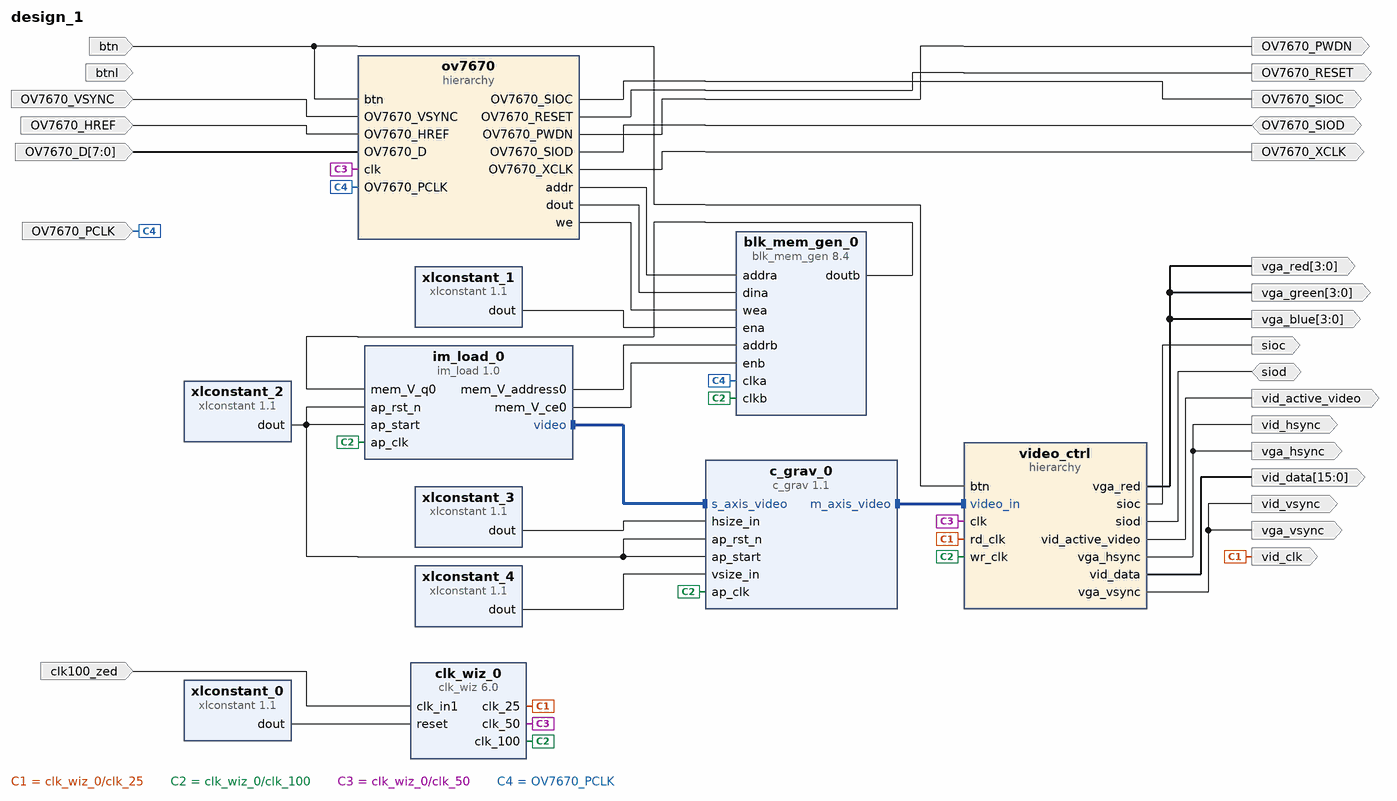
[diagram p0: block diagram of the top level]
# Vivado block design design_1, xc7z020clg484-1, Vivado 2019.2
create_bd_design design_1

create_bd_port -dir I -type clk clk100_zed
create_bd_port -dir O -from 3 -to 0 vga_red
create_bd_port -dir O -from 3 -to 0 vga_green
create_bd_port -dir O -from 3 -to 0 vga_blue
create_bd_port -dir O vga_hsync
create_bd_port -dir O vga_vsync
create_bd_port -dir I btnl
create_bd_port -dir O -from 15 -to 0 vid_data
create_bd_port -dir O vid_hsync
create_bd_port -dir O vid_vsync
create_bd_port -dir O vid_clk
create_bd_port -dir O vid_active_video
create_bd_port -dir IO siod
create_bd_port -dir O sioc
create_bd_port -dir I btn
create_bd_port -dir O OV7670_SIOC
create_bd_port -dir IO OV7670_SIOD
create_bd_port -dir O -type rst OV7670_RESET
create_bd_port -dir O OV7670_PWDN
create_bd_port -dir O OV7670_XCLK
create_bd_port -dir I OV7670_PCLK
create_bd_port -dir I OV7670_VSYNC
create_bd_port -dir I OV7670_HREF
create_bd_port -dir I -from 7 -to 0 OV7670_D

create_bd_cell -type ip -vlnv xilinx.com:ip:clk_wiz:6.0 clk_wiz_0
set_property -dict [list \
  CONFIG.CLKOUT1_JITTER 130.958 \
  CONFIG.CLKOUT1_REQUESTED_OUT_FREQ 100.000 \
  CONFIG.CLKOUT2_JITTER 151.636 \
  CONFIG.CLKOUT2_PHASE_ERROR 98.575 \
  CONFIG.CLKOUT2_REQUESTED_OUT_FREQ 50.000 \
  CONFIG.CLKOUT2_USED true \
  CONFIG.CLKOUT3_JITTER 175.402 \
  CONFIG.CLKOUT3_PHASE_ERROR 98.575 \
  CONFIG.CLKOUT3_REQUESTED_OUT_FREQ 25.000 \
  CONFIG.CLKOUT3_USED true \
  CONFIG.CLK_OUT1_PORT clk_100 \
  CONFIG.CLK_OUT2_PORT clk_50 \
  CONFIG.CLK_OUT3_PORT clk_25 \
  CONFIG.MMCM_CLKOUT0_DIVIDE_F 10.000 \
  CONFIG.MMCM_CLKOUT1_DIVIDE 20 \
  CONFIG.MMCM_CLKOUT2_DIVIDE 40 \
  CONFIG.NUM_OUT_CLKS 3 \
] [get_bd_cells clk_wiz_0]
create_bd_cell -type ip -vlnv xilinx.com:ip:xlconstant:1.1 xlconstant_0
set_property -dict {CONFIG.CONST_VAL 0} [get_bd_cells xlconstant_0]
create_bd_cell -type hier video_ctrl
create_bd_cell -type ip -vlnv xilinx.com:ip:xlconstant:1.1 xlconstant_2
create_bd_cell -type ip -vlnv xilinx.com:hls:im_load:1.0 im_load_0
create_bd_cell -type ip -vlnv xilinx.com:ip:blk_mem_gen:8.4 blk_mem_gen_0
set_property -dict [list \
  CONFIG.Enable_32bit_Address false \
  CONFIG.Enable_A Use_ENA_Pin \
  CONFIG.Enable_B Use_ENB_Pin \
  CONFIG.Load_Init_File false \
  CONFIG.Memory_Type Simple_Dual_Port_RAM \
  CONFIG.Operating_Mode_A NO_CHANGE \
  CONFIG.Port_B_Clock 100 \
  CONFIG.Port_B_Enable_Rate 100 \
  CONFIG.Read_Width_B 8 \
  CONFIG.Register_PortB_Output_of_Memory_Primitives true \
  CONFIG.Use_Byte_Write_Enable false \
  CONFIG.Use_RSTB_Pin false \
  CONFIG.Write_Depth_A 307200 \
  CONFIG.Write_Width_A 8 \
  CONFIG.Write_Width_B 8 \
  CONFIG.use_bram_block Stand_Alone \
] [get_bd_cells blk_mem_gen_0]
create_bd_cell -type ip -vlnv xilinx.com:ip:xlconstant:1.1 xlconstant_1
set_property -dict {CONFIG.CONST_VAL 1} [get_bd_cells xlconstant_1]
create_bd_cell -type hier ov7670
create_bd_cell -type ip -vlnv xilinx.com:hls:c_grav:1.1 c_grav_0
create_bd_cell -type ip -vlnv xilinx.com:ip:xlconstant:1.1 xlconstant_3
set_property -dict {CONFIG.CONST_VAL 640 CONFIG.CONST_WIDTH 32} [get_bd_cells xlconstant_3]
create_bd_cell -type ip -vlnv xilinx.com:ip:xlconstant:1.1 xlconstant_4
set_property -dict {CONFIG.CONST_VAL 480 CONFIG.CONST_WIDTH 32} [get_bd_cells xlconstant_4]

# ---- hierarchy /video_ctrl ----
current_bd_instance /video_ctrl
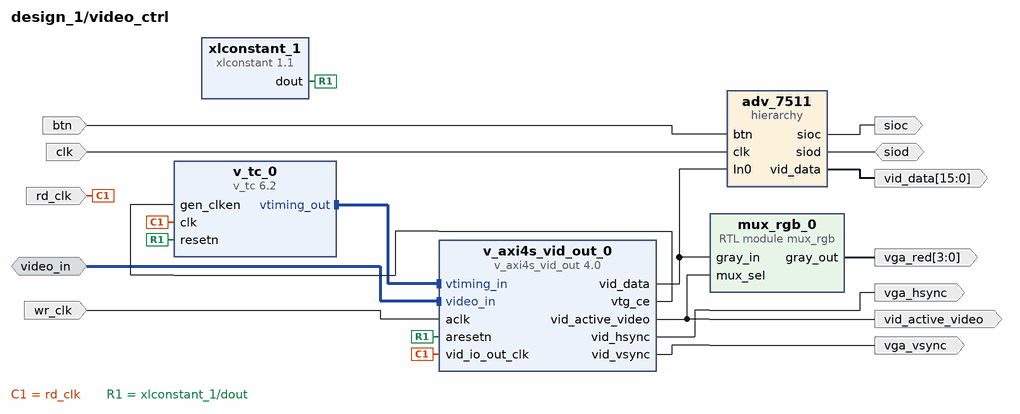
[diagram p1: block diagram inside /video_ctrl]
create_bd_intf_pin -mode Slave -vlnv xilinx.com:interface:axis_rtl:1.0 video_in
create_bd_pin -dir I -type clk rd_clk
create_bd_pin -dir O vga_hsync
create_bd_pin -dir O vga_vsync
create_bd_pin -dir I -type clk wr_clk
create_bd_pin -dir O vid_active_video
create_bd_pin -dir O -from 15 -to 0 vid_data
create_bd_pin -dir I btn
create_bd_pin -dir IO siod
create_bd_pin -dir O sioc
create_bd_pin -dir I -type clk clk
create_bd_pin -dir O -from 3 -to 0 vga_red

create_bd_cell -type ip -vlnv xilinx.com:ip:xlconstant:1.1 xlconstant_1
create_bd_cell -type ip -vlnv xilinx.com:ip:v_tc:6.2 v_tc_0
set_property -dict [list \
  CONFIG.FSYNC_VSTART0 524 \
  CONFIG.HAS_AXI4_LITE false \
  CONFIG.VIDEO_MODE 480p \
  CONFIG.enable_detection false \
  CONFIG.horizontal_blank_generation true \
  CONFIG.vertical_blank_generation true \
] [get_bd_cells v_tc_0]
create_bd_cell -type ip -vlnv xilinx.com:ip:v_axi4s_vid_out:4.0 v_axi4s_vid_out_0
set_property -dict {CONFIG.C_HAS_ASYNC_CLK 1 CONFIG.C_S_AXIS_VIDEO_FORMAT 12} [get_bd_cells v_axi4s_vid_out_0]
create_bd_cell -type hier adv_7511
create_bd_cell -type module -reference mux_rgb mux_rgb_0

# ---- hierarchy /video_ctrl/adv_7511 ----
current_bd_instance /video_ctrl/adv_7511
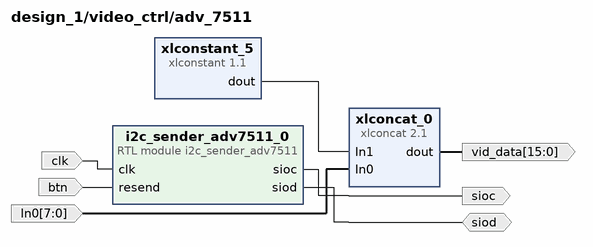
[diagram p2: block diagram inside /video_ctrl/adv_7511]
create_bd_pin -dir I -from 7 -to 0 In0
create_bd_pin -dir O -from 15 -to 0 vid_data
create_bd_pin -dir I -type clk clk
create_bd_pin -dir I btn
create_bd_pin -dir O sioc
create_bd_pin -dir IO siod

create_bd_cell -type ip -vlnv xilinx.com:ip:xlconcat:2.1 xlconcat_0
set_property -dict {CONFIG.IN0_WIDTH 8 CONFIG.IN1_WIDTH 8} [get_bd_cells xlconcat_0]
create_bd_cell -type module -reference i2c_sender_adv7511 i2c_sender_adv7511_0
create_bd_cell -type ip -vlnv xilinx.com:ip:xlconstant:1.1 xlconstant_5
set_property -dict {CONFIG.CONST_VAL 127 CONFIG.CONST_WIDTH 8} [get_bd_cells xlconstant_5]

# ---- hierarchy /ov7670 ----
current_bd_instance /ov7670
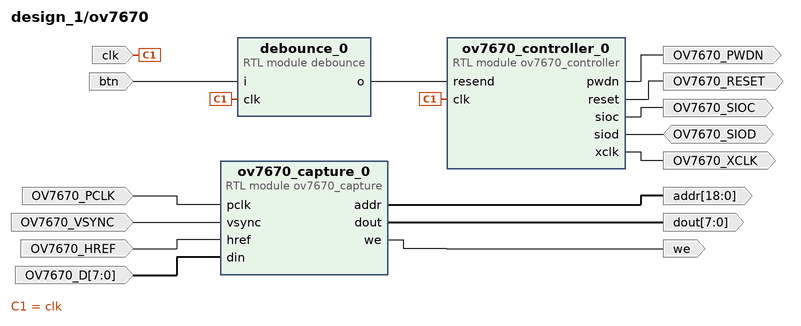
[diagram p3: block diagram inside /ov7670]
create_bd_pin -dir I -type clk clk
create_bd_pin -dir O OV7670_SIOC
create_bd_pin -dir IO OV7670_SIOD
create_bd_pin -dir O -type rst OV7670_RESET
create_bd_pin -dir O OV7670_PWDN
create_bd_pin -dir O OV7670_XCLK
create_bd_pin -dir I btn
create_bd_pin -dir I OV7670_PCLK
create_bd_pin -dir I OV7670_VSYNC
create_bd_pin -dir I OV7670_HREF
create_bd_pin -dir I -from 7 -to 0 OV7670_D
create_bd_pin -dir O -from 18 -to 0 addr
create_bd_pin -dir O -from 7 -to 0 dout
create_bd_pin -dir O we

create_bd_cell -type module -reference ov7670_controller ov7670_controller_0
create_bd_cell -type module -reference debounce debounce_0
create_bd_cell -type module -reference ov7670_capture ov7670_capture_0

# ---- connections ----

current_bd_instance /video_ctrl
connect_bd_intf_net [get_bd_intf_pins video_in] [get_bd_intf_pins v_axi4s_vid_out_0/video_in]
connect_bd_intf_net [get_bd_intf_pins v_tc_0/vtiming_out] [get_bd_intf_pins v_axi4s_vid_out_0/vtiming_in]
connect_bd_net -net clk_wiz_0_clk_25 [get_bd_pins rd_clk] [get_bd_pins v_tc_0/clk] [get_bd_pins v_axi4s_vid_out_0/vid_io_out_clk]
connect_bd_net [get_bd_pins v_axi4s_vid_out_0/vtg_ce] [get_bd_pins v_tc_0/gen_clken]
connect_bd_net [get_bd_pins wr_clk] [get_bd_pins v_axi4s_vid_out_0/aclk]
connect_bd_net [get_bd_pins v_axi4s_vid_out_0/vid_hsync] [get_bd_pins vga_hsync]
connect_bd_net [get_bd_pins v_axi4s_vid_out_0/vid_vsync] [get_bd_pins vga_vsync]
connect_bd_net [get_bd_pins xlconstant_1/dout] [get_bd_pins v_tc_0/resetn] [get_bd_pins v_axi4s_vid_out_0/aresetn]
connect_bd_net [get_bd_pins v_axi4s_vid_out_0/vid_data] [get_bd_pins adv_7511/In0] [get_bd_pins mux_rgb_0/gray_in]
connect_bd_net [get_bd_pins v_axi4s_vid_out_0/vid_active_video] [get_bd_pins vid_active_video] [get_bd_pins mux_rgb_0/mux_sel]
connect_bd_net -net xlconcat_0_dout [get_bd_pins adv_7511/vid_data] [get_bd_pins vid_data]
connect_bd_net [get_bd_pins btn] [get_bd_pins adv_7511/btn]
connect_bd_net [get_bd_pins siod] [get_bd_pins adv_7511/siod]
connect_bd_net -net i2c_sender_adv7511_0_sioc [get_bd_pins adv_7511/sioc] [get_bd_pins sioc]
connect_bd_net [get_bd_pins clk] [get_bd_pins adv_7511/clk]
connect_bd_net [get_bd_pins mux_rgb_0/gray_out] [get_bd_pins vga_red]

current_bd_instance /video_ctrl/adv_7511
connect_bd_net [get_bd_pins xlconstant_5/dout] [get_bd_pins xlconcat_0/In1]
connect_bd_net -net v_axi4s_vid_out_0_vid_data [get_bd_pins In0] [get_bd_pins xlconcat_0/In0]
connect_bd_net [get_bd_pins xlconcat_0/dout] [get_bd_pins vid_data]
connect_bd_net [get_bd_pins clk] [get_bd_pins i2c_sender_adv7511_0/clk]
connect_bd_net [get_bd_pins btn] [get_bd_pins i2c_sender_adv7511_0/resend]
connect_bd_net [get_bd_pins i2c_sender_adv7511_0/sioc] [get_bd_pins sioc]
connect_bd_net [get_bd_pins siod] [get_bd_pins i2c_sender_adv7511_0/siod]

current_bd_instance /ov7670
connect_bd_net [get_bd_pins debounce_0/o] [get_bd_pins ov7670_controller_0/resend]
connect_bd_net -net clk_wiz_0_clk_50 [get_bd_pins clk] [get_bd_pins debounce_0/clk] [get_bd_pins ov7670_controller_0/clk]
connect_bd_net [get_bd_pins ov7670_controller_0/sioc] [get_bd_pins OV7670_SIOC]
connect_bd_net [get_bd_pins OV7670_SIOD] [get_bd_pins ov7670_controller_0/siod]
connect_bd_net [get_bd_pins ov7670_controller_0/reset] [get_bd_pins OV7670_RESET]
connect_bd_net [get_bd_pins ov7670_controller_0/pwdn] [get_bd_pins OV7670_PWDN]
connect_bd_net [get_bd_pins ov7670_controller_0/xclk] [get_bd_pins OV7670_XCLK]
connect_bd_net -net i_0_1 [get_bd_pins btn] [get_bd_pins debounce_0/i]
connect_bd_net -net pclk_0_1 [get_bd_pins OV7670_PCLK] [get_bd_pins ov7670_capture_0/pclk]
connect_bd_net -net vsync_0_1 [get_bd_pins OV7670_VSYNC] [get_bd_pins ov7670_capture_0/vsync]
connect_bd_net -net href_0_1 [get_bd_pins OV7670_HREF] [get_bd_pins ov7670_capture_0/href]
connect_bd_net -net din_0_1 [get_bd_pins OV7670_D] [get_bd_pins ov7670_capture_0/din]
connect_bd_net [get_bd_pins ov7670_capture_0/addr] [get_bd_pins addr]
connect_bd_net [get_bd_pins ov7670_capture_0/dout] [get_bd_pins dout]
connect_bd_net [get_bd_pins ov7670_capture_0/we] [get_bd_pins we]

current_bd_instance /
connect_bd_intf_net [get_bd_intf_pins im_load_0/video] [get_bd_intf_pins c_grav_0/s_axis_video]
connect_bd_intf_net [get_bd_intf_pins c_grav_0/m_axis_video] [get_bd_intf_pins video_ctrl/video_in]
connect_bd_net -net clk_in1_0_1 [get_bd_ports clk100_zed] [get_bd_pins clk_wiz_0/clk_in1]
connect_bd_net [get_bd_pins xlconstant_0/dout] [get_bd_pins clk_wiz_0/reset]
connect_bd_net [get_bd_pins clk_wiz_0/clk_25] [get_bd_pins video_ctrl/rd_clk] [get_bd_ports vid_clk]
connect_bd_net -net v_tc_0_vsync_out [get_bd_pins video_ctrl/vga_vsync] [get_bd_ports vga_vsync] [get_bd_ports vid_vsync]
connect_bd_net -net xlslice_1_Dout [get_bd_pins video_ctrl/vga_red] [get_bd_ports vga_red] [get_bd_ports vga_green] [get_bd_ports vga_blue]
connect_bd_net -net v_tc_0_hsync_out [get_bd_pins video_ctrl/vga_hsync] [get_bd_ports vga_hsync] [get_bd_ports vid_hsync]
connect_bd_net [get_bd_pins clk_wiz_0/clk_100] \
  [get_bd_pins video_ctrl/wr_clk] [get_bd_pins im_load_0/ap_clk] [get_bd_pins blk_mem_gen_0/clkb] \
  [get_bd_pins c_grav_0/ap_clk]
connect_bd_net [get_bd_pins xlconstant_2/dout] \
  [get_bd_pins im_load_0/ap_start] [get_bd_pins im_load_0/ap_rst_n] [get_bd_pins c_grav_0/ap_rst_n] \
  [get_bd_pins c_grav_0/ap_start]
connect_bd_net [get_bd_pins video_ctrl/vid_active_video] [get_bd_ports vid_active_video]
connect_bd_net [get_bd_pins xlconstant_1/dout] [get_bd_pins blk_mem_gen_0/ena]
connect_bd_net [get_bd_pins blk_mem_gen_0/doutb] [get_bd_pins im_load_0/mem_V_q0]
connect_bd_net [get_bd_pins im_load_0/mem_V_address0] [get_bd_pins blk_mem_gen_0/addrb]
connect_bd_net [get_bd_pins im_load_0/mem_V_ce0] [get_bd_pins blk_mem_gen_0/enb]
connect_bd_net [get_bd_pins clk_wiz_0/clk_50] [get_bd_pins video_ctrl/clk] [get_bd_pins ov7670/clk]
connect_bd_net -net i_0_1 [get_bd_ports btn] [get_bd_pins video_ctrl/btn] [get_bd_pins ov7670/btn]
connect_bd_net -net ov7670_controller_0_sioc [get_bd_pins ov7670/OV7670_SIOC] [get_bd_ports OV7670_SIOC]
connect_bd_net [get_bd_ports OV7670_SIOD] [get_bd_pins ov7670/OV7670_SIOD]
connect_bd_net -net ov7670_controller_0_reset [get_bd_pins ov7670/OV7670_RESET] [get_bd_ports OV7670_RESET]
connect_bd_net -net ov7670_controller_0_pwdn [get_bd_pins ov7670/OV7670_PWDN] [get_bd_ports OV7670_PWDN]
connect_bd_net -net ov7670_controller_0_xclk [get_bd_pins ov7670/OV7670_XCLK] [get_bd_ports OV7670_XCLK]
connect_bd_net -net pclk_0_1 [get_bd_ports OV7670_PCLK] [get_bd_pins blk_mem_gen_0/clka] [get_bd_pins ov7670/OV7670_PCLK]
connect_bd_net -net vsync_0_1 [get_bd_ports OV7670_VSYNC] [get_bd_pins ov7670/OV7670_VSYNC]
connect_bd_net -net href_0_1 [get_bd_ports OV7670_HREF] [get_bd_pins ov7670/OV7670_HREF]
connect_bd_net -net din_0_1 [get_bd_ports OV7670_D] [get_bd_pins ov7670/OV7670_D]
connect_bd_net -net ov7670_capture_0_addr [get_bd_pins ov7670/addr] [get_bd_pins blk_mem_gen_0/addra]
connect_bd_net -net ov7670_capture_0_dout [get_bd_pins ov7670/dout] [get_bd_pins blk_mem_gen_0/dina]
connect_bd_net -net ov7670_capture_0_we [get_bd_pins ov7670/we] [get_bd_pins blk_mem_gen_0/wea]
connect_bd_net [get_bd_pins video_ctrl/vid_data] [get_bd_ports vid_data]
connect_bd_net [get_bd_ports siod] [get_bd_pins video_ctrl/siod]
connect_bd_net [get_bd_pins video_ctrl/sioc] [get_bd_ports sioc]
connect_bd_net [get_bd_pins xlconstant_3/dout] [get_bd_pins c_grav_0/hsize_in]
connect_bd_net [get_bd_pins xlconstant_4/dout] [get_bd_pins c_grav_0/vsize_in]

validate_bd_design
save_bd_design
